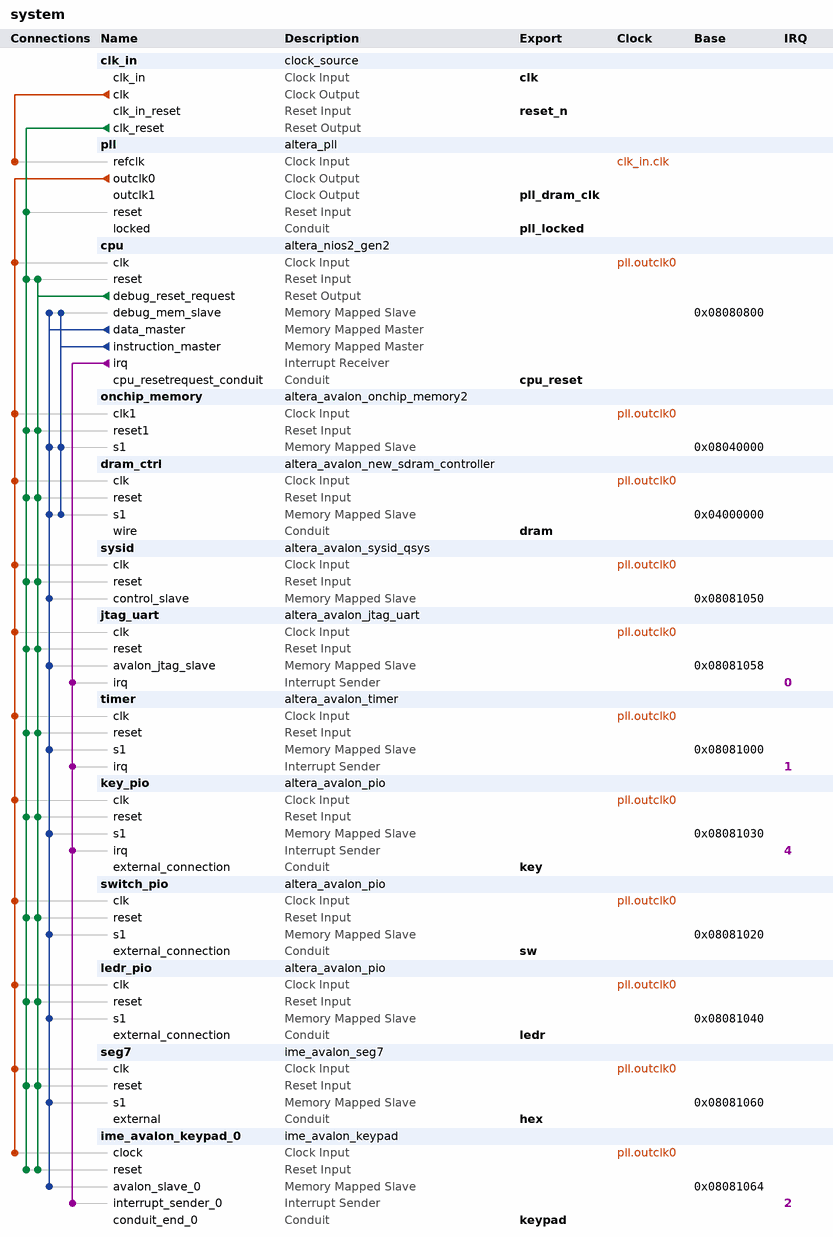
[diagram p0: system contents]
# Platform Designer (Qsys) system system, Cyclone V 5CSEMA5F31C6
# Parameters at their usual value, and those the tool derives, are not listed.
package require -exact qsys 17.1
create_system system
set_project_property DEVICE_FAMILY {Cyclone V}
set_project_property DEVICE 5CSEMA5F31C6

add_instance clk_in clock_source 17.1
set_instance_parameter_value clk_in clockFrequency 50000000
set_instance_parameter_value clk_in resetSynchronousEdges DEASSERT

add_instance pll altera_pll 17.1
set_instance_parameter_value pll gui_device_speed_grade 2
set_instance_parameter_value pll gui_number_of_clocks 2
set_instance_parameter_value pll gui_operation_mode direct
set_instance_parameter_value pll gui_output_clock_frequency0 50.0
set_instance_parameter_value pll gui_output_clock_frequency1 50.0
set_instance_parameter_value pll gui_phase_shift1 -3333
set_instance_parameter_value pll gui_pll_mode {Integer-N PLL}
set_instance_parameter_value pll gui_reference_clock_frequency 50.0
set_instance_parameter_value pll gui_use_locked true

add_instance cpu altera_nios2_gen2 17.1
set_instance_parameter_value cpu cpuReset true
set_instance_parameter_value cpu dcache_size 0
set_instance_parameter_value cpu exceptionSlave dram_ctrl.s1
set_instance_parameter_value cpu icache_size 4096
set_instance_parameter_value cpu impl Fast
set_instance_parameter_value cpu mmu_processIDNumBits 10
set_instance_parameter_value cpu resetSlave dram_ctrl.s1
set_instance_parameter_value cpu setting_activateTrace true

add_instance onchip_memory altera_avalon_onchip_memory2 17.1
set_instance_parameter_value onchip_memory dataWidth 32
set_instance_parameter_value onchip_memory dualPort false
set_instance_parameter_value onchip_memory initMemContent true
set_instance_parameter_value onchip_memory initializationFileName onchip_memory
set_instance_parameter_value onchip_memory memorySize 160000

add_instance dram_ctrl altera_avalon_new_sdram_controller 17.1
set_instance_parameter_value dram_ctrl TAC 5.5
set_instance_parameter_value dram_ctrl TRCD 20.0
set_instance_parameter_value dram_ctrl TRP 20.0
set_instance_parameter_value dram_ctrl casLatency 3
set_instance_parameter_value dram_ctrl columnWidth 10
set_instance_parameter_value dram_ctrl dataWidth 16
set_instance_parameter_value dram_ctrl generateSimulationModel false
set_instance_parameter_value dram_ctrl model single_Micron_MT48LC4M32B2_7_chip
set_instance_parameter_value dram_ctrl numberOfBanks 4
set_instance_parameter_value dram_ctrl numberOfChipSelects 1
set_instance_parameter_value dram_ctrl powerUpDelay 100.0
set_instance_parameter_value dram_ctrl refreshPeriod 15.625
set_instance_parameter_value dram_ctrl rowWidth 13

add_instance sysid altera_avalon_sysid_qsys 17.1
set_instance_parameter_value sysid id 33

add_instance jtag_uart altera_avalon_jtag_uart 17.1
set_instance_parameter_value jtag_uart simInteractiveOptions INTERACTIVE_ASCII_OUTPUT

add_instance timer altera_avalon_timer 17.1
set_instance_parameter_value timer period 1.0
set_instance_parameter_value timer periodUnits MSEC

add_instance key_pio altera_avalon_pio 17.1
set_instance_parameter_value key_pio captureEdge true
set_instance_parameter_value key_pio direction Input
set_instance_parameter_value key_pio edgeType FALLING
set_instance_parameter_value key_pio generateIRQ true
set_instance_parameter_value key_pio irqType EDGE
set_instance_parameter_value key_pio simDoTestBenchWiring true
set_instance_parameter_value key_pio width 4

add_instance switch_pio altera_avalon_pio 17.1
set_instance_parameter_value switch_pio direction Input
set_instance_parameter_value switch_pio simDoTestBenchWiring true
set_instance_parameter_value switch_pio width 8

add_instance ledr_pio altera_avalon_pio 17.1
set_instance_parameter_value ledr_pio direction Output
set_instance_parameter_value ledr_pio width 8

add_instance seg7 ime_avalon_seg7 13.0

add_instance ime_avalon_keypad_0 ime_avalon_keypad 17.1

# connections
add_connection clk_in.clk pll.refclk clock
add_connection pll.outclk0 cpu.clk clock
add_connection pll.outclk0 dram_ctrl.clk clock
add_connection pll.outclk0 ime_avalon_keypad_0.clock clock
add_connection pll.outclk0 jtag_uart.clk clock
add_connection pll.outclk0 key_pio.clk clock
add_connection pll.outclk0 ledr_pio.clk clock
add_connection pll.outclk0 onchip_memory.clk1 clock
add_connection pll.outclk0 seg7.clk clock
add_connection pll.outclk0 switch_pio.clk clock
add_connection pll.outclk0 sysid.clk clock
add_connection pll.outclk0 timer.clk clock
add_connection clk_in.clk_reset cpu.reset reset
add_connection clk_in.clk_reset dram_ctrl.reset reset
add_connection clk_in.clk_reset ime_avalon_keypad_0.reset reset
add_connection clk_in.clk_reset jtag_uart.reset reset
add_connection clk_in.clk_reset key_pio.reset reset
add_connection clk_in.clk_reset ledr_pio.reset reset
add_connection clk_in.clk_reset onchip_memory.reset1 reset
add_connection clk_in.clk_reset pll.reset reset
add_connection clk_in.clk_reset seg7.reset reset
add_connection clk_in.clk_reset switch_pio.reset reset
add_connection clk_in.clk_reset sysid.reset reset
add_connection clk_in.clk_reset timer.reset reset
add_connection cpu.debug_reset_request cpu.reset reset
add_connection cpu.debug_reset_request dram_ctrl.reset reset
add_connection cpu.debug_reset_request ime_avalon_keypad_0.reset reset
add_connection cpu.debug_reset_request jtag_uart.reset reset
add_connection cpu.debug_reset_request key_pio.reset reset
add_connection cpu.debug_reset_request ledr_pio.reset reset
add_connection cpu.debug_reset_request onchip_memory.reset1 reset
add_connection cpu.debug_reset_request seg7.reset reset
add_connection cpu.debug_reset_request switch_pio.reset reset
add_connection cpu.debug_reset_request sysid.reset reset
add_connection cpu.debug_reset_request timer.reset reset
add_connection cpu.data_master cpu.debug_mem_slave avalon
set_connection_parameter_value cpu.data_master/cpu.debug_mem_slave baseAddress 0x08080800
add_connection cpu.data_master dram_ctrl.s1 avalon
set_connection_parameter_value cpu.data_master/dram_ctrl.s1 baseAddress 0x04000000
add_connection cpu.data_master ime_avalon_keypad_0.avalon_slave_0 avalon
set_connection_parameter_value cpu.data_master/ime_avalon_keypad_0.avalon_slave_0 baseAddress 0x08081064
add_connection cpu.data_master jtag_uart.avalon_jtag_slave avalon
set_connection_parameter_value cpu.data_master/jtag_uart.avalon_jtag_slave baseAddress 0x08081058
add_connection cpu.data_master key_pio.s1 avalon
set_connection_parameter_value cpu.data_master/key_pio.s1 baseAddress 0x08081030
add_connection cpu.data_master ledr_pio.s1 avalon
set_connection_parameter_value cpu.data_master/ledr_pio.s1 baseAddress 0x08081040
add_connection cpu.data_master onchip_memory.s1 avalon
set_connection_parameter_value cpu.data_master/onchip_memory.s1 baseAddress 0x08040000
add_connection cpu.data_master seg7.s1 avalon
set_connection_parameter_value cpu.data_master/seg7.s1 baseAddress 0x08081060
add_connection cpu.data_master switch_pio.s1 avalon
set_connection_parameter_value cpu.data_master/switch_pio.s1 baseAddress 0x08081020
add_connection cpu.data_master sysid.control_slave avalon
set_connection_parameter_value cpu.data_master/sysid.control_slave baseAddress 0x08081050
add_connection cpu.data_master timer.s1 avalon
set_connection_parameter_value cpu.data_master/timer.s1 baseAddress 0x08081000
add_connection cpu.instruction_master cpu.debug_mem_slave avalon
set_connection_parameter_value cpu.instruction_master/cpu.debug_mem_slave baseAddress 0x08080800
add_connection cpu.instruction_master dram_ctrl.s1 avalon
set_connection_parameter_value cpu.instruction_master/dram_ctrl.s1 baseAddress 0x04000000
add_connection cpu.instruction_master onchip_memory.s1 avalon
set_connection_parameter_value cpu.instruction_master/onchip_memory.s1 baseAddress 0x08040000
add_connection cpu.irq ime_avalon_keypad_0.interrupt_sender_0 interrupt
set_connection_parameter_value cpu.irq/ime_avalon_keypad_0.interrupt_sender_0 irqNumber 2
add_connection cpu.irq jtag_uart.irq interrupt
set_connection_parameter_value cpu.irq/jtag_uart.irq irqNumber 0
add_connection cpu.irq key_pio.irq interrupt
set_connection_parameter_value cpu.irq/key_pio.irq irqNumber 4
add_connection cpu.irq timer.irq interrupt
set_connection_parameter_value cpu.irq/timer.irq irqNumber 1

# exported interfaces
add_interface clk clock sink
set_interface_property clk EXPORT_OF clk_in.clk_in
add_interface cpu_reset conduit end
set_interface_property cpu_reset EXPORT_OF cpu.cpu_resetrequest_conduit
add_interface dram conduit end
set_interface_property dram EXPORT_OF dram_ctrl.wire
add_interface hex conduit end
set_interface_property hex EXPORT_OF seg7.external
add_interface key conduit end
set_interface_property key EXPORT_OF key_pio.external_connection
add_interface keypad conduit end
set_interface_property keypad EXPORT_OF ime_avalon_keypad_0.conduit_end_0
add_interface ledr conduit end
set_interface_property ledr EXPORT_OF ledr_pio.external_connection
add_interface pll_dram_clk clock source
set_interface_property pll_dram_clk EXPORT_OF pll.outclk1
add_interface pll_locked conduit end
set_interface_property pll_locked EXPORT_OF pll.locked
add_interface reset_n reset sink
set_interface_property reset_n EXPORT_OF clk_in.clk_in_reset
add_interface sw conduit end
set_interface_property sw EXPORT_OF switch_pio.external_connection

set_interconnect_requirement {$system} qsys_mm.clockCrossingAdapter HANDSHAKE
set_interconnect_requirement {$system} qsys_mm.maxAdditionalLatency 0

save_system system.qsys
